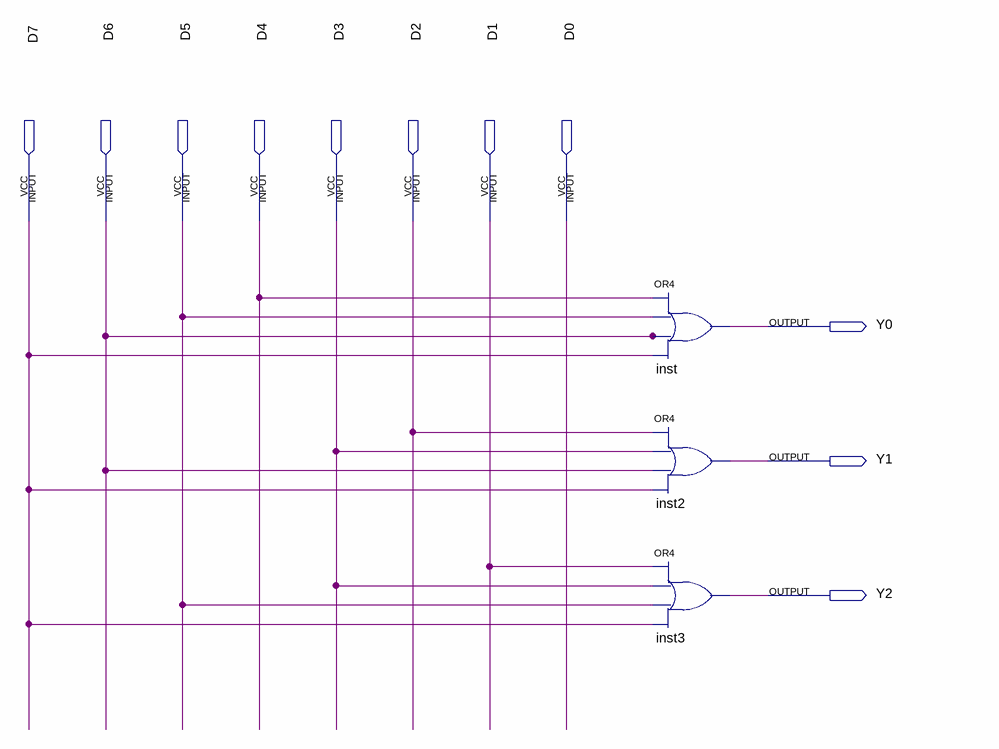
[diagram p0: schematic sheet]
// Quartus schematic 8to3Encoder_Block_diagram.bdf as structural Verilog: 3 symbols, 11 pins
module \8to3Encoder_Block_diagram  (
  input  D7,
  input  D6,
  input  D5,
  input  D4,
  input  D3,
  input  D2,
  input  D1,
  input  D0,
  output Y0,
  output Y1,
  output Y2
);

  or inst (Y0, D4, D5, D6, D7);
  or inst2 (Y1, D2, D3, D6, D7);
  or inst3 (Y2, D1, D3, D5, D7);
endmodule
